# EAGLE design prototype_v03 (EAGLE 5.12)
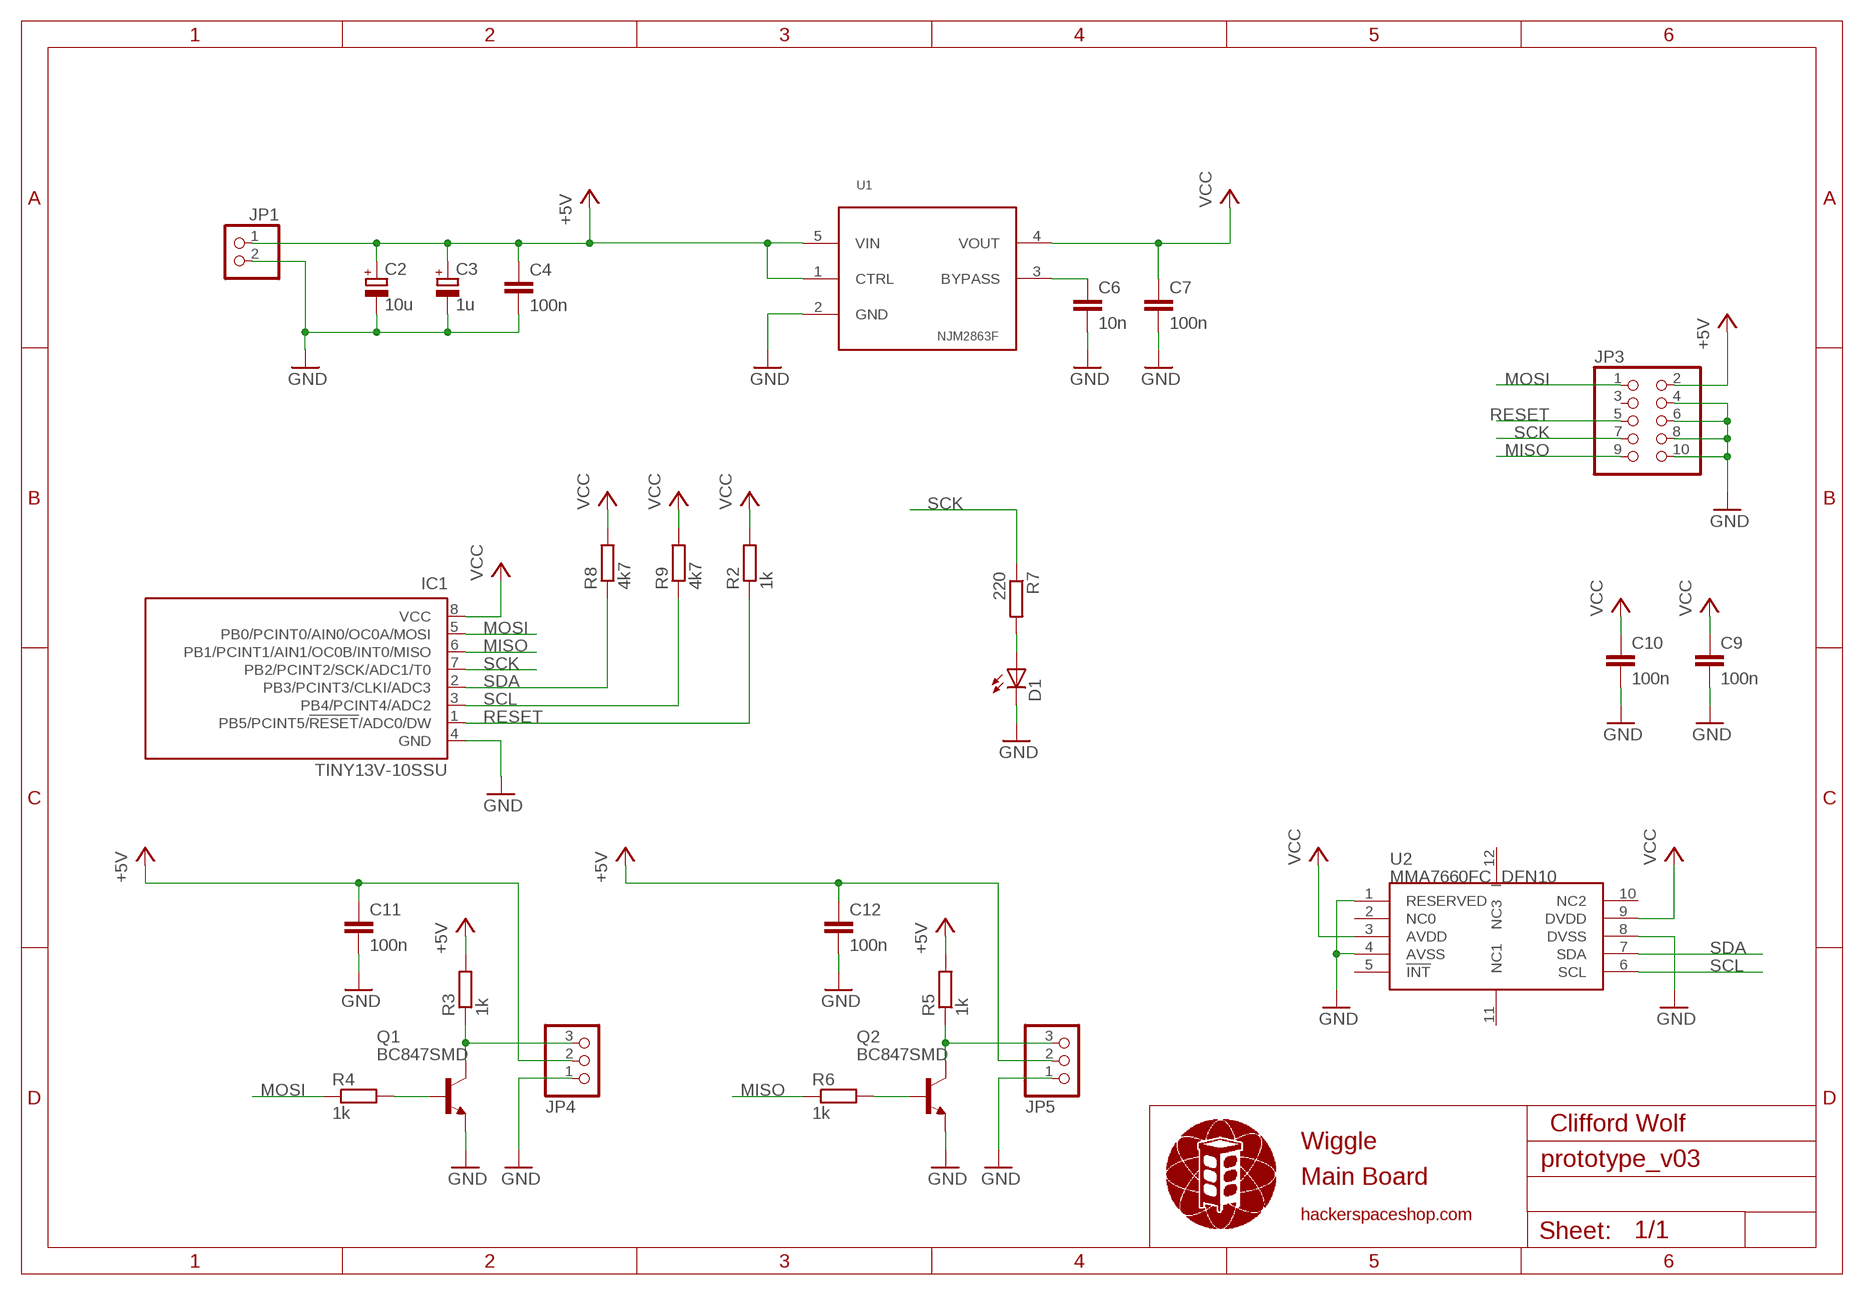
[diagram p0: schematic, sheet 1]

## Parts
C2  10u  CPOL-EUB  [PANASONIC_B]
C3  1u  CPOL-EUB  [PANASONIC_B]
C4  100n  C-EUC0805  [C0805]
C6  10n  C-EUC0805  [C0805]
C7  100n  C-EUC0805  [C0805]
C9  100n  C-EUC0805  [C0805]
C10  100n  C-EUC0805  [C0805]
C11  100n  C-EUC0805  [C0805]
C12  100n  C-EUC0805  [C0805]
D1  LEDSML0805  [SML0805]
IC1  TINY13V-10SSU  [8S1]
JP1  PINHD-1X2  [1X02]
JP3  TC2050-IDC-NLTC2050-IDC-NL  [TC2050-IDC-NL]
JP4  PINHD-1X3  [1X03]
JP5  PINHD-1X3  [1X03]
Q1  BC847SMD  [SOT23]
Q2  BC847SMD  [SOT23]
R2  1k  R-EU_R0805  [R0805]
R3  1k  R-EU_R0805  [R0805]
R4  1k  R-EU_R0805  [R0805]
R5  1k  R-EU_R0805  [R0805]
R6  1k  R-EU_R0805  [R0805]
R7  220  R-EU_R0805  [R0805]
R8  4k7  R-EU_R0805  [R0805]
R9  4k7  R-EU_R0805  [R0805]
U1  NJM2863F  [SOT23-5L]
U2  MMA7660FC_DFN10  [DFN10]

## Nets
+5V [pwr]: C2.+ C3.+ C4.1 C11.1 C12.1 JP1.1 JP3.2 JP4.2 JP5.2 R3.2 R5.2 U1.1(CTRL) U1.5(VIN)
GND [pwr]: C2.- C3.- C4.2 C6.2 C7.2 C9.2 C10.2 C11.2 C12.2 D1.C IC1.4(GND) JP1.2 JP3.4 JP3.6 JP3.8 JP3.10 JP4.1 JP5.1 Q1.2(E) Q2.2(E) U1.2(GND) U2.1(RESERVED) U2.4(AVSS) U2.8(DVSS)
MISO: IC1.6(PB1/PCINT1/AIN1/OC0B/INT0/MISO) JP3.9 R6.1
MOSI: IC1.5(PB0/PCINT0/AIN0/OC0A/MOSI) JP3.1 R4.1
N$1: JP4.3 Q1.3(C) R3.1
N$2: Q1.1(B) R4.2
N$4: C6.1 U1.3(BYPASS)
N$5: D1.A R7.2
N$7: JP5.3 Q2.3(C) R5.1
N$10: Q2.1(B) R6.2
RESET: IC1.1(PB5/PCINT5/!RESET!/ADC0/DW) JP3.5 R2.1
SCK: IC1.7(PB2/PCINT2/SCK/ADC1/T0) JP3.7 R7.1
SCL: IC1.3(PB4/PCINT4/ADC2) R9.1 U2.6(SCL)
SDA: IC1.2(PB3/PCINT3/CLKI/ADC3) R8.1 U2.7(SDA)
VCC [pwr]: C7.1 C9.1 C10.1 IC1.8(VCC) R2.2 R8.2 R9.2 U1.4(VOUT) U2.3(AVDD) U2.9(DVDD)
Unconnected: JP3.3 U2.2(NC0) U2.5(!INT) U2.10(NC2) U2.11(NC1) U2.12(NC3)

## Notes on the sheet
- Clifford Wolf
- Wiggle
- Main Board
- hackerspaceshop.com

## Library data of the parts
C2 C3 = resistor:CPOL-EU: POLARIZED CAPACITOR, European symbol
C4 C6 C7 C9-C12 = resistor:C-EU: CAPACITOR, European symbol
D1 = led:LED: LED OSRAM: - CHIPLED LG R971, LG N971, LY N971, LG Q971, LY Q971, LO R971, LY R971 LH N974, LH R974 LS Q976, LO Q976, LY Q976 LO Q996 - Hyper CHIPLED LW Q18S LB Q993, LB Q99A, LB R99A - SideLED LS A670, LO A670, LY A670, LG A670, LP A670 LB A673, LV A673, LT A673, LW A673 LH A674 LY A675 LS A676, LA A676, LO A676, LY A676, LW A676 LS A679, LY A679, LG A679 - Hyper Micro SIDELED® LS Y876, LA Y876, LO Y876, LY Y876 LT Y87S - SmartLED LW L88C, LW L88S LB L89C, LB L89S, LG L890 LS L89K, LO L89K, LY L89K LS L896, LA L896, LO L896, LY L896 - TOPLED LS T670, LO T670, LY T670, LG T670, LP T670 LSG T670, LSP T670, LSY T670, LOP T670, LYG T670 LG T671, LOG T671, LSG T671 LB T673, LV T673, LT T673, LW T673 LH T674 LS T676, LA T676, LO T676, LY T676, LB T676, LH T676, LSB T676, LW T676 LB T67C, LV T67C, LT T67C, LS T67K, LO T67K, LY T67K, LW E67C LS E67B, LA E67B, LO E67B, LY E67B, LB E67C, LV E67C, LT E67C LW T67C LS T679, LY T679, LG T679 LS T770, LO T770, LY T770, LG T770, LP T770 LB T773, LV T773, LT T773, LW T773 LH T774 LS E675, LA E675, LY E675, LS T675 LS T776, LA T776, LO T776, LY T776, LB T776 LHGB T686 LT T68C, LB T68C - Hyper Mini TOPLED® LB M676 - Mini TOPLED Santana® LG M470 LS M47K, LO M47K, LY M47K Source: http://www.osram.convergy.de LUXEON: - LUMILED® LXK2-PW12-R00, LXK2-PW12-S00, LXK2-PW14-U00, LXK2-PW14-V00 LXK2-PM12-R00, LXK2-PM12-S00, LXK2-PM14-U00 LXK2-PE12-Q00, LXK2-PE12-R00, LXK2-PE12-S00, LXK2-PE14-T00, LXK2-PE14-U00 LXK2-PB12-K00, LXK2-PB12-L00, LXK2-PB12-M00, LXK2-PB14-N00, LXK2-PB14-P00, LXK2-PB14-Q00 LXK2-PR12-L00, LXK2-PR12-M00, LXK2-PR14-Q00, LXK2-PR14-R00 LXK2-PD12-Q00, LXK2-PD12-R00, LXK2-PD12-S00 LXK2-PH12-R00, LXK2-PH12-S00 LXK2-PL12-P00, LXK2-PL12-Q00, LXK2-PL12-R00 Source: www.luxeon.com KINGBRIGHT: KA-3528ASYC Source: www.kingbright.com
IC1 = parts:TINY13: 8-bit AVR Microcontroller with 1K Bytes In-System Programmable Flash Source: http://www.atmel.com/dyn/resources/prod_documents/2535S.pdf
JP1 = mpc_pinhead:PINHD-1X2: PIN HEADER
JP3 = parts:TC2050-IDC-NL: PIN HEADER
JP4 JP5 = mpc_pinhead:PINHD-1X3: PIN HEADER
Q1 Q2 = transistor-npn:BC847*: NPN Transistor
R2-R9 = resistor:R-EU_: RESISTOR, European symbol
U1 = parts:NJM2863F
U2 = ICs_v54:MMA7660FC

## Net classes
1 pwr: width 0.254 mm

## Board
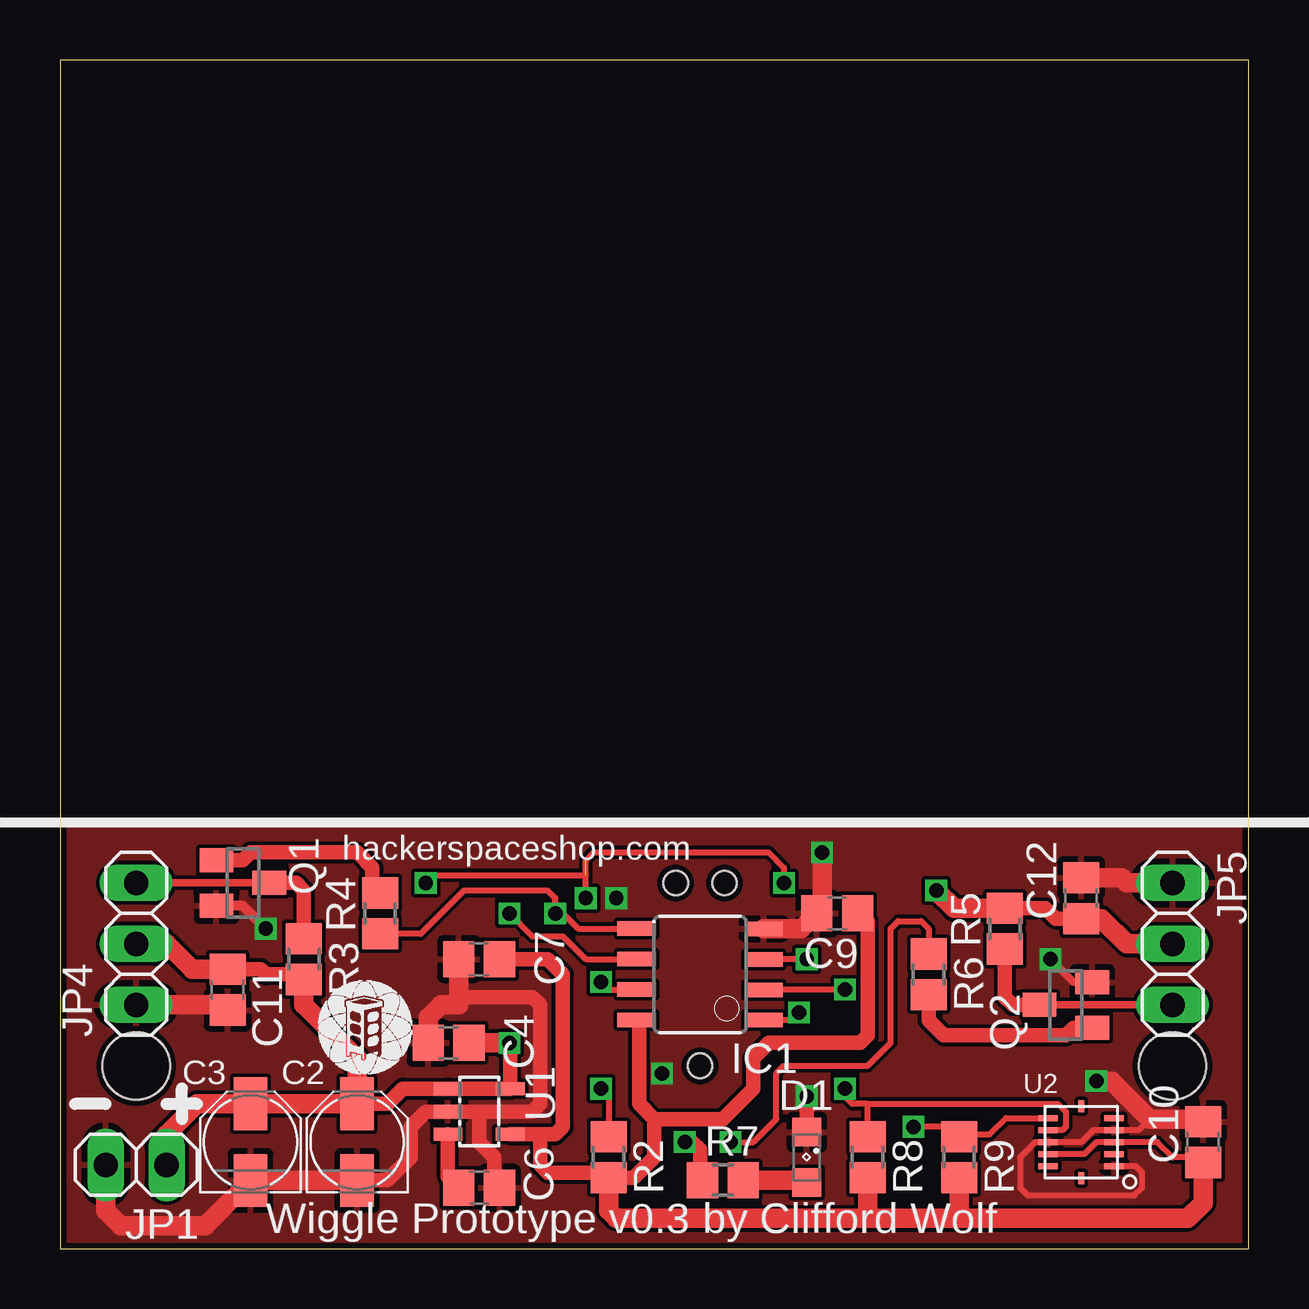
[diagram p1: board, top side]
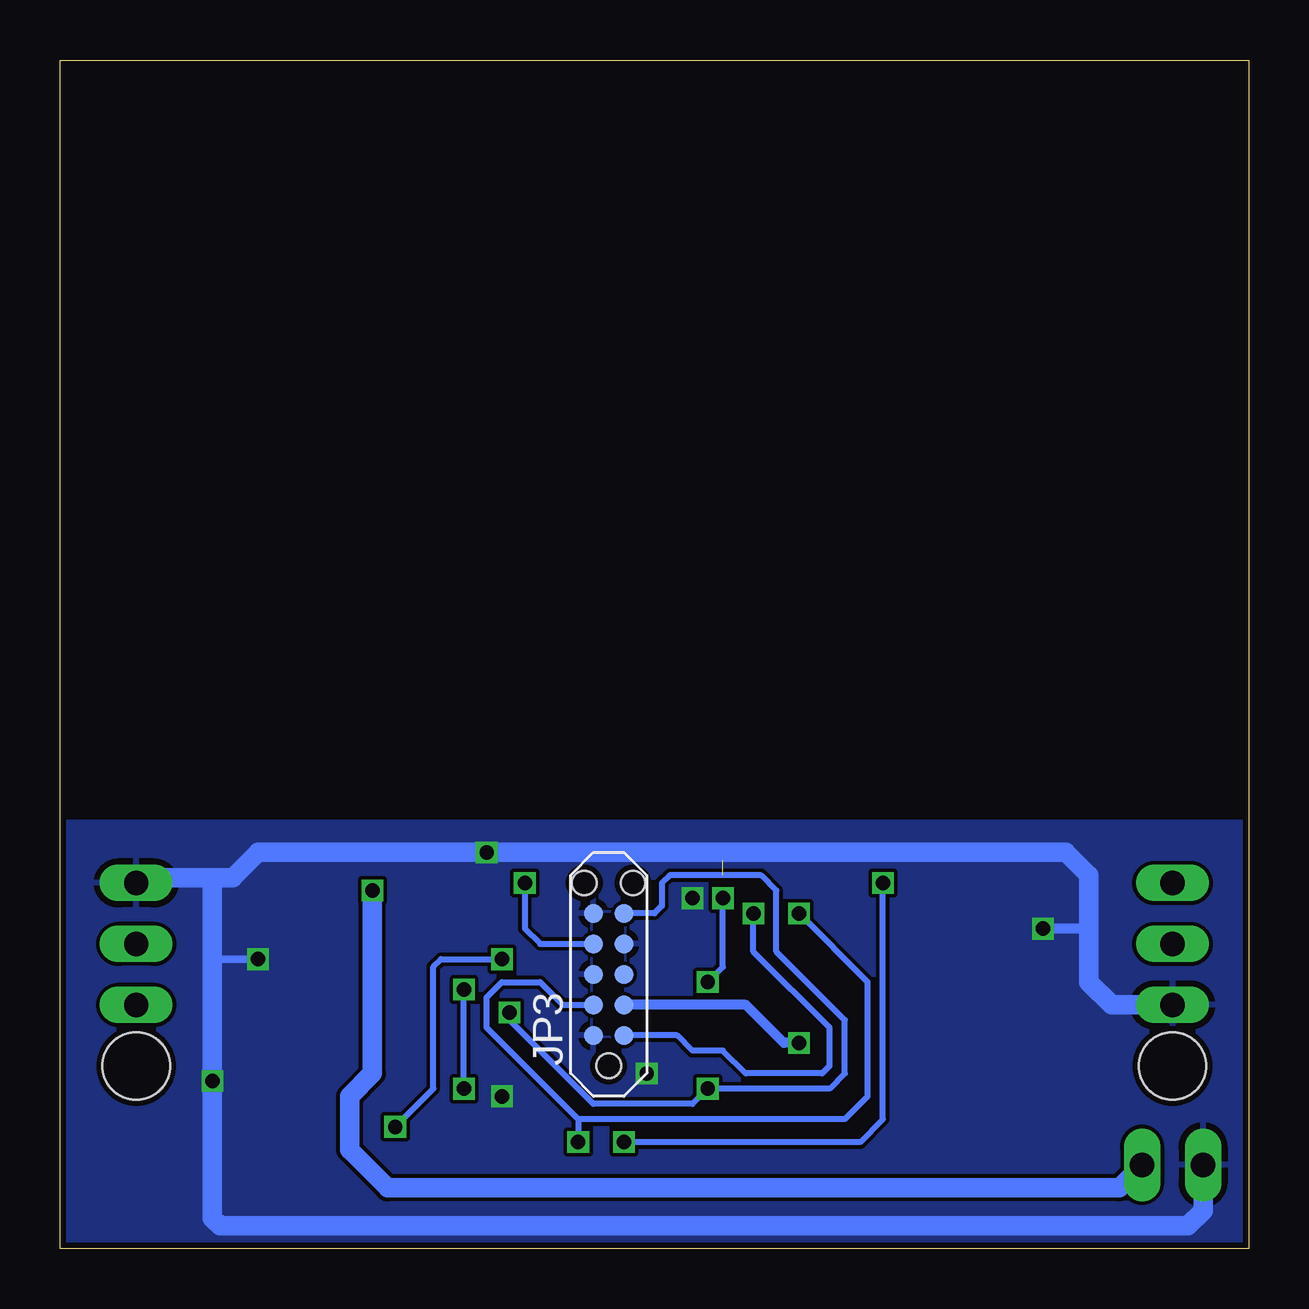
[diagram p2: board, bottom side, seen from below]

Size 49.53 x 49.53 mm. Coordinates in mm from the lower left corner, seen from the top.
Outline: 0,0 49.53,0 49.53,49.53 0,49.53 0,0
Copper layers (1*16): Top 0.035mm / dielectric 1.5mm / Bottom 0.035mm
Design rules "seeed *": minimum track width 6mil, minimum drill 12mil, track to track 6mil, track to pad 6mil, pad to pad 6mil, via to via 6mil, smd to smd 0mil, copper to edge 10mil, drill to drill 10mil, minimum pad ring 10mil, minimum via ring 6mil, stop-mask expansion 2mil, vias tented up to drill 100mil, thermal gap 10mil
Holes 2.8 mm at 3.17,7.62 46.35,7.62

### Footprints (pad centres in the part's own frame; a part is rotated, then mirrored left to right if it is on the bottom)
PANASONIC_B = smd 2.2 x 1.4: + 1.6,0; - -1.6,0
C0805 = smd 1.3 x 1.5: 1 -0.85,0; 2 0.85,0
SML0805 = smd 1.2 x 1.2: A 1.05,0; C -1.05,0
8S1 = smd 0.6 x 1.6: 1 -1.905,-2.654; 2 -0.645,-2.654; 3 0.625,-2.654; 4 1.895,-2.654; 5 1.905,2.654; 6 0.635,2.654; 7 -0.635,2.654; 8 -1.905,2.654
1X02 = drill 1.016 long: 1 -1.27,0; 2 1.27,0
TC2050-IDC-NL = smd 0.787 x 0.787: 1 1.27,-0.635; 2 2.54,-0.635; 3 3.81,-0.635; 4 5.08,-0.635; 5 6.35,-0.635; 6 6.35,0.635; 7 5.08,0.635; 8 3.81,0.635; 9 2.54,0.635; 10 1.27,0.635 | hole 1.016: 0,0; 7.62,1.016; 7.62,-1.016
1X03 = drill 1.016 long: 1 -2.54,0; 2 0,0; 3 2.54,0
SOT23 = smd 1 x 1.4: 1 -0.95,-1.1; 2 0.95,-1.1; 3 0,1.1
R0805 = smd 1.3 x 1.5: 1 -0.85,0; 2 0.85,0
SOT23-5L = smd 0.55 x 1.2: 1 -0.95,-1.3; 2 0,-1.3; 3 0.95,-1.3; 4 0.95,1.3; 5 -0.95,1.3
DFN10 = smd 0.8 x 0.25: 1 -1.375,1; 2 -1.375,0.5; 3 -1.375,0; 4 -1.375,-0.5; 5 -1.375,-1; 6 1.375,-1; 7 1.375,-0.5; 8 1.375,0; 9 1.375,0.5; 10 1.375,1 | smd 0.25 x 0.5: 11 0,-1.5; 12 0,1.5

### Placement (x,y rotation side)
C2  12.38,4.45 90 top
C3  7.94,4.45 90 top
C4  16.19,8.57 180 top
C6  17.46,2.54 0 top
C7  17.46,12.06 180 top
C9  32.38,13.97 180 top
C10  47.62,4.45 90 top
C11  6.99,10.79 270 top
C12  42.55,14.61 90 top
D1  31.11,3.81 270 top
IC1  26.67,11.43 90 top
JP1  3.17,3.49 180 top
JP3  26.67,7.62 90 bottom
JP4  3.17,12.7 90 top
JP5  46.35,12.7 270 top
Q1  7.62,15.24 270 top
Q2  41.91,10.16 90 top
R2  22.86,3.81 270 top
R3  10.16,12.06 270 top
R4  13.34,13.97 90 top
R5  39.37,13.34 90 top
R6  36.2,11.43 270 top
R7  27.62,2.86 0 top
R8  33.66,3.81 270 top
R9  37.47,3.81 270 top
U1  17.46,5.71 270 top
U2  42.55,4.45 180 top
U$1  [METALAB]  12.7,9.21 0 top

### Tracks (layer width: path | path; a pad name or v marks a point on that pad's centre or on a via)
+5V  (via drill 0.6)
  Top 0.61: C2.+ 13.66,6.04 14.29,6.67 U1.1 U1.5 18.76,8.54 v18.73,8.57 | C11.1 8.36,11.64 8.57,11.43 9.95,11.43 R3.2 | R5.2 41.06,14.19 41.49,13.76 C12.1
  Top 0.813: JP1.1 4.45,4.76 5.73,6.04 C3.+ C2.+ 12.38,7.94 10.16,10.16 R3.2 | C11.1 5.5,11.64 4.45,12.7 JP4.2 | C12.1 43.4,13.76 44.45,12.7 JP5.2 | R5.2 37.25,14.19 v36.51,14.92 | v18.73,8.57 C4.1
  Bottom 0.406: v18.73,8.57 19.37,8.57 20.95,10.16 JP3.2
  Bottom 0.813: v36.51,14.92 36.51,7.3 37.47,6.35 37.47,4.13 35.88,2.54 5.4,2.54 JP1.1
GND  (via drill 0.6)
  Top 0.254: U2.1 44.81,3.44 45.09,3.17 45.09,2.54 44.77,2.22 40.32,2.22 40.01,2.54 40.01,3.81 40.64,4.45 U2.8 42.55,4.45 43.05,4.95 U2.4 44.95,4.95 45.4,5.4
  Top 0.305: Q2.2 42.23,11.11 v41.27,12.06 | 47.52,5.4 C10.2
  Top 0.406: Q1.2 7.62,14.29 v8.57,13.34
  Top 0.61: IC1.4 29.33,13.34 | C2.- 13.64,2.85 14.61,3.81 14.61,5.08 15.24,5.71 U1.2 17.46,5.71 | C6.2 18.1,2.75 18.1,3.81 17.46,4.45 17.46,5.71 | 17.46,5.71 19.68,5.71 20,6.03 20,10.16 19.68,10.48 16.93,10.48 16.61,10.16 | D1.C v31.11,6.35
  Top 0.813: JP1.2 1.91,1.59 2.54,0.95 6.04,0.95 C3.- C2.- | JP4.1 6.77,10.16 C11.2 | C12.2 44.23,15.46 44.45,15.24 JP5.1 | C7.2 16.61,10.16 15.88,10.16 15.34,9.63 C4.2 | IC1.4 30.89,13.32 C9.2 31.75,14.19 v31.75,16.51 | 47.52,5.4 45.4,5.4 43.81,6.99 v43.18,6.99
  Bottom 0.305: v41.27,12.06 42.86,12.06 43.18,12.38
  Bottom 0.406: 6.67,13.34 v8.57,13.34
  Bottom 0.813: JP1.2 1.91,1.59 2.54,0.95 42.86,0.95 43.18,1.27 v43.18,6.99 43.18,12.38 43.18,15.46 | JP5.1 46.14,15.46 43.18,15.46 | 43.18,15.46 42.33,15.46 41.27,16.51 v31.75,16.51 7.62,16.51 6.67,15.56 6.67,13.34 6.67,11.11 5.71,10.16 JP4.1
  other vias: 25.08,7.3 23.18,14.61
  pour Bottom: 0,17.78 0,0 49.53,0 49.53,17.78
  pour Top: 0,17.78 0,0 49.53,0 49.53,17.78
MISO  (via drill 0.6)
  Top 0.254: IC1.6 21.91,12.06 20.95,13.02 19.68,13.02 v18.73,13.97 | R6.1 36.2,13.34 35.88,13.65 34.92,13.65 34.61,13.34 34.61,8.57 33.66,7.62 30.16,7.62 29.84,7.3 29.84,5.4 28.89,4.45 v27.94,4.45 28.26,4.45
  Bottom 0.254: JP3.9 28.57,10.16 29.53,11.11 31.11,11.11 31.75,10.48 31.75,9.21 27.94,5.4 | 27.94,5.4 v27.94,4.45 | v18.73,13.97 15.88,11.11 15.88,6.35 16.83,5.4 27.94,5.4
MOSI  (via drill 0.6)
  Top 0.254: IC1.5 21.59,13.34 20.95,13.97 v20.64,13.97 20.64,14.61 20.32,14.92 16.83,14.92 15.03,13.12 R4.1
  Bottom 0.254: JP3.1 23.81,8.89 23.18,8.26 21.91,8.26 20.95,7.3 17.78,7.3 17.46,7.62 17.46,9.21 20.64,12.38 v20.64,13.97
N$1
  Top 0.305: JP4.3 Q1.3
  Top 0.61: R3.1 10.16,14.92 9.84,15.24 Q1.3
N$2
  Top 0.61: R4.2 13.02,15.14 13.02,15.88 12.38,16.51 7.94,16.51 7.62,16.19 Q1.1
N$4
  Top 0.61: U1.3 16.16,2.99 C6.1
N$5
  Top 0.813: R7.2 31.02,2.86 D1.A
N$7
  Top 0.305: Q2.3 JP5.3
  Top 0.61: Q2.3 39.69,10.16 39.37,10.48 R5.1
N$10
  Top 0.61: R6.2 36.2,9.53 36.83,8.89 41.91,8.89 42.23,9.21 Q2.1
RESET  (via drill 0.6)
  Top 0.254: IC1.1 30.48,9.53 v30.8,9.84 | R2.1 22.86,6.35 v22.54,6.67
  Bottom 0.254: v30.8,9.84 30.8,9.53 27.3,6.03 23.18,6.03 v22.54,6.67 17.46,6.67 16.83,7.3 16.83,9.53 19.68,12.38 19.68,14.92 20.32,15.56 24.13,15.56 24.45,15.24 24.45,14.29 24.77,13.97 JP3.5
SCK  (via drill 0.6)  (1 unrouted)
  Top 0.254: v30.16,15.24 30.16,15.88 29.53,16.51 22.23,16.51 21.91,16.19 v21.91,14.61 | v22.54,11.11 22.86,10.79 IC1.7 | v15.24,15.24 15.56,15.56 21.91,15.56
  Top 0.61: v26.04,4.45 26.35,4.45 26.67,4.13 26.67,2.96 R7.1
  Bottom 0.254: JP3.7 29.53,12.7 30.16,13.34 v30.16,15.24 | v26.04,4.45 16.19,4.45 15.24,5.4 v15.24,15.24 | v21.91,14.61 21.91,11.75 v22.54,11.11
SCL  (via drill 0.6)
  Top 0.254: U2.6 39.42,5.45 38.73,4.76 37.57,4.76 R9.1 37.05,5.08 v35.56,5.08 | IC1.3 v31.11,12.05 v31.11,12.06
  Bottom 0.254: v31.11,12.06 33.66,12.06 33.97,11.75 33.97,6.67 v35.56,5.08
SDA  (via drill 0.6)
  Top 0.254: U2.7 41.77,4.95 41.91,5.08 41.91,5.71 41.59,6.03 33.66,6.03 | IC1.2 v32.69,10.79 v32.7,10.79 | v32.7,6.67 32.7,6.35 33.02,6.03 33.66,6.03 | R8.1 33.66,6.03
  Bottom 0.254: v32.7,6.67 v32.7,10.79
VCC
  Top 0.254: C10.1 47.41,3.81 46.35,3.81 45.72,4.45 U2.3 43.18,4.45 42.68,3.94 U2.9
  Top 0.61: C9.1 33.34,13.97 33.66,13.65 33.66,8.89 33.34,8.57 29.53,8.57 28.89,7.94 28.89,6.67 27.62,5.4 24.77,5.4 | IC1.8 24.13,9.41 24.13,6.03 24.77,5.4 | U1.4 19.68,4.76 20,4.76 | 24.77,5.4 24.77,3.81 23.91,2.96 R2.2 22.64,3.17 20.32,3.17 20,3.49 20,4.76 | C7.1 20.32,12.06 20.95,11.43 20.95,5.08 20.64,4.76 20,4.76
  Top 0.813: C10.1 47.62,1.91 46.99,1.27 37.47,1.27 | 33.66,1.27 23.18,1.27 22.86,1.59 R2.2 | 33.66,1.27 37.47,1.27 | 37.47,1.27 R9.2 | 33.66,1.27 R8.2

### Text on the board
tPlace: hackerspaceshop.com | Wiggle Prototype v0.3 by Clifford Wolf